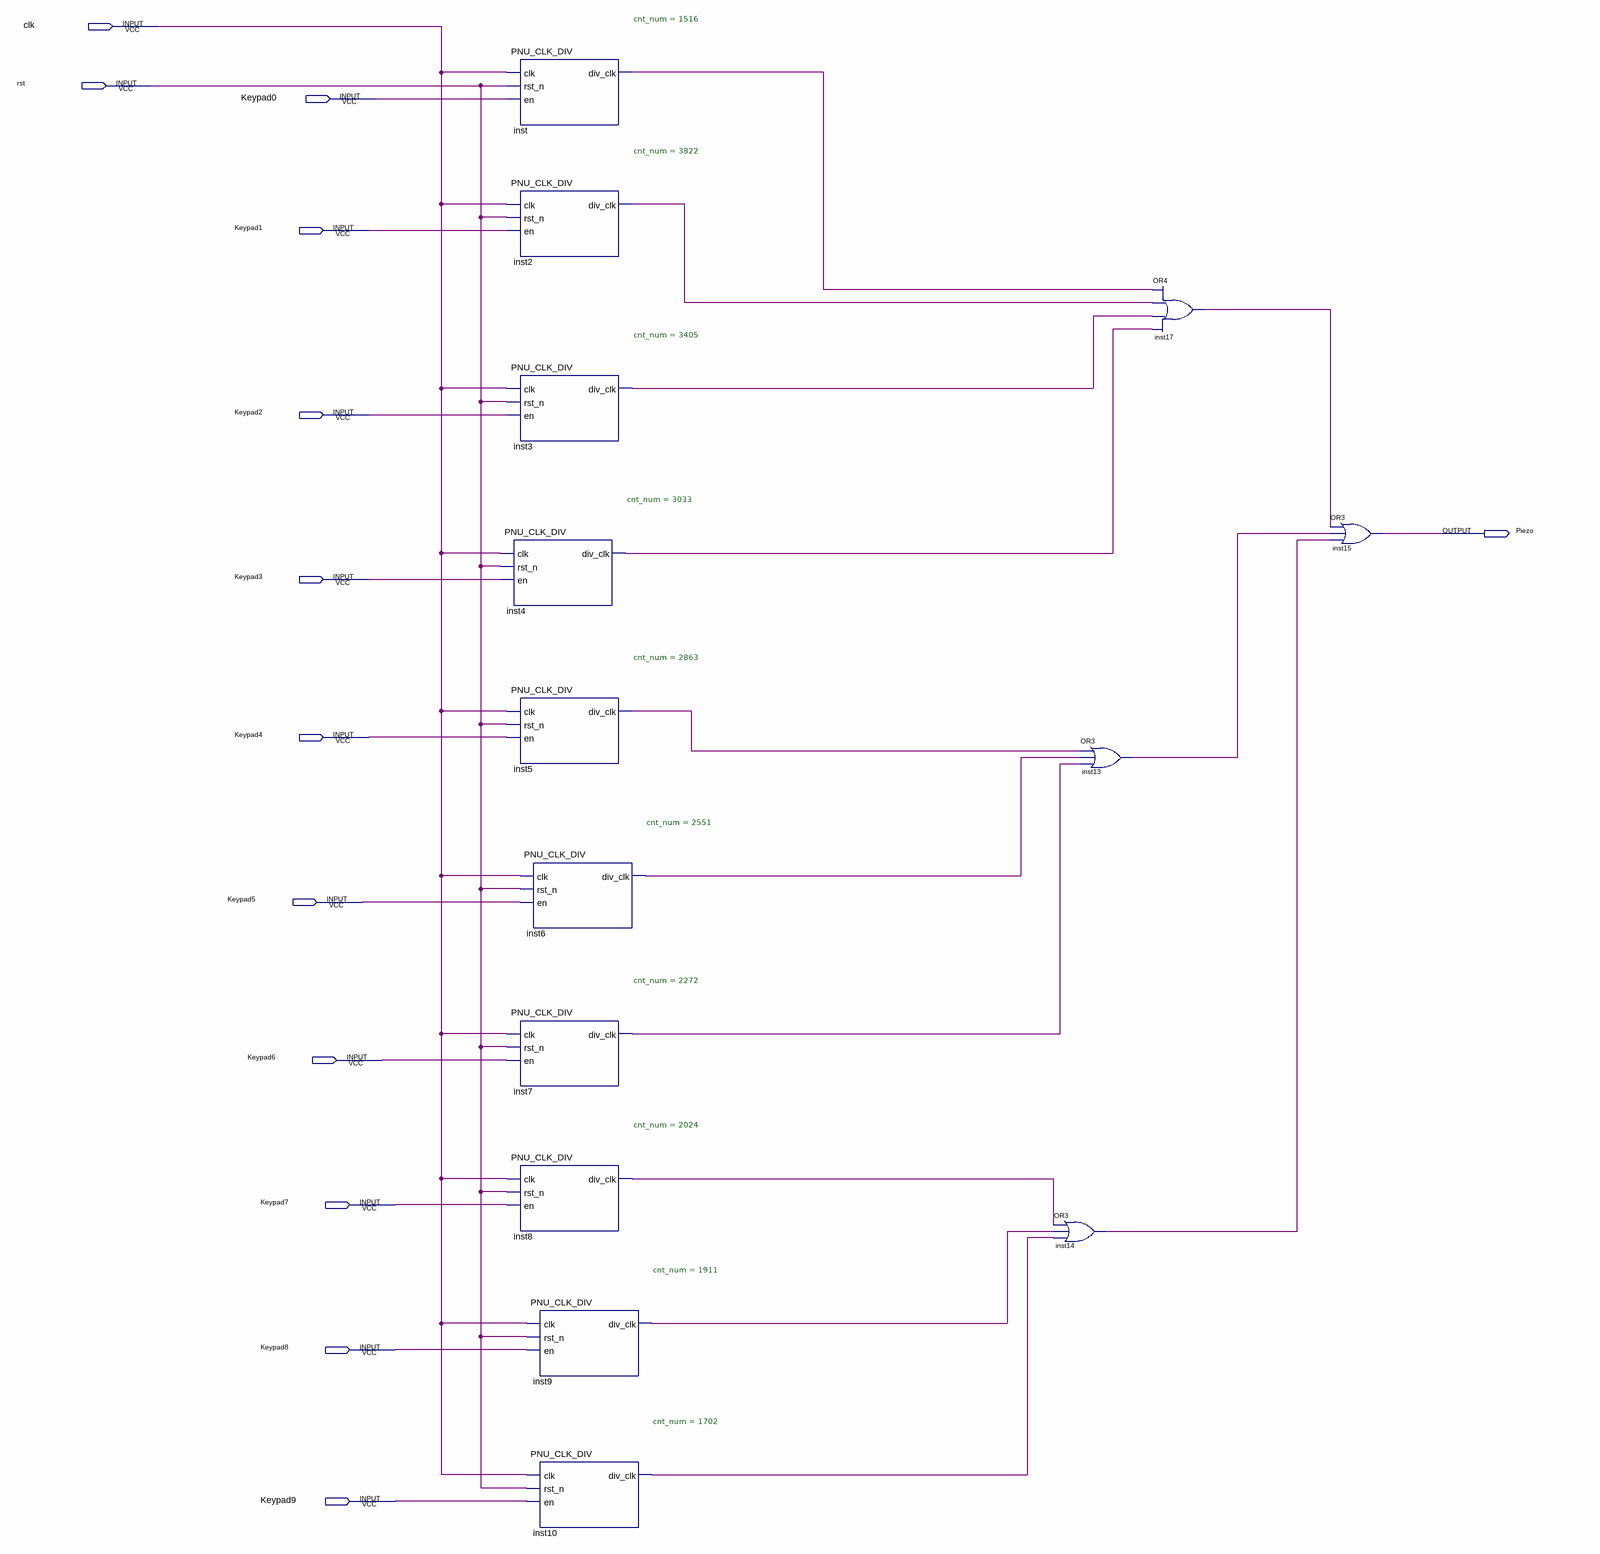
[diagram p0: schematic sheet]
// Quartus schematic Piezo_module.bdf as structural Verilog: 14 symbols, 13 pins
module Piezo_module (
  input  clk,
  input  rst,
  input  Keypad0,
  input  Keypad1,
  input  Keypad2,
  input  Keypad3,
  input  Keypad4,
  input  Keypad5,
  input  Keypad6,
  input  Keypad7,
  input  Keypad8,
  input  Keypad9,
  output Piezo
);

  wire inst2_div_clk, inst3_div_clk, inst4_div_clk, inst5_div_clk, inst6_div_clk, inst7_div_clk,
       inst8_div_clk, inst9_div_clk, inst10_div_clk, inst13_out, inst14_out, inst17_out, inst_div_clk;

  PNU_CLK_DIV #(.cnt_num(1516)) inst (.clk(clk), .rst_n(rst), .en(Keypad0), .div_clk(inst_div_clk));
  PNU_CLK_DIV #(.cnt_num(3822)) inst2 (.clk(clk), .rst_n(rst), .en(Keypad1), .div_clk(inst2_div_clk));
  PNU_CLK_DIV #(.cnt_num(3405)) inst3 (.clk(clk), .rst_n(rst), .en(Keypad2), .div_clk(inst3_div_clk));
  PNU_CLK_DIV #(.cnt_num(3033)) inst4 (.clk(clk), .rst_n(rst), .en(Keypad3), .div_clk(inst4_div_clk));
  PNU_CLK_DIV #(.cnt_num(2863)) inst5 (.clk(clk), .rst_n(rst), .en(Keypad4), .div_clk(inst5_div_clk));
  PNU_CLK_DIV #(.cnt_num(2551)) inst6 (.clk(clk), .rst_n(rst), .en(Keypad5), .div_clk(inst6_div_clk));
  PNU_CLK_DIV #(.cnt_num(2272)) inst7 (.clk(clk), .rst_n(rst), .en(Keypad6), .div_clk(inst7_div_clk));
  PNU_CLK_DIV #(.cnt_num(2024)) inst8 (.clk(clk), .rst_n(rst), .en(Keypad7), .div_clk(inst8_div_clk));
  PNU_CLK_DIV #(.cnt_num(1911)) inst9 (.clk(clk), .rst_n(rst), .en(Keypad8), .div_clk(inst9_div_clk));
  PNU_CLK_DIV #(.cnt_num(1702)) inst10 (.clk(clk), .rst_n(rst), .en(Keypad9), .div_clk(inst10_div_clk));
  or inst14 (inst14_out, inst8_div_clk, inst9_div_clk, inst10_div_clk);
  or inst13 (inst13_out, inst5_div_clk, inst6_div_clk, inst7_div_clk);
  or inst17 (inst17_out, inst_div_clk, inst2_div_clk, inst3_div_clk, inst4_div_clk);
  or inst15 (Piezo, inst17_out, inst13_out, inst14_out);
endmodule
